# EasyEDA schematic SCH_Schematic-PCB-FC-TD_2026-05-04.json
TITLE: Flight Controller; REV: 1.0; Date: 2026-04-28; Sheet: 1/1; Drawn By: dimassetya737; Company: Dwi Cakra
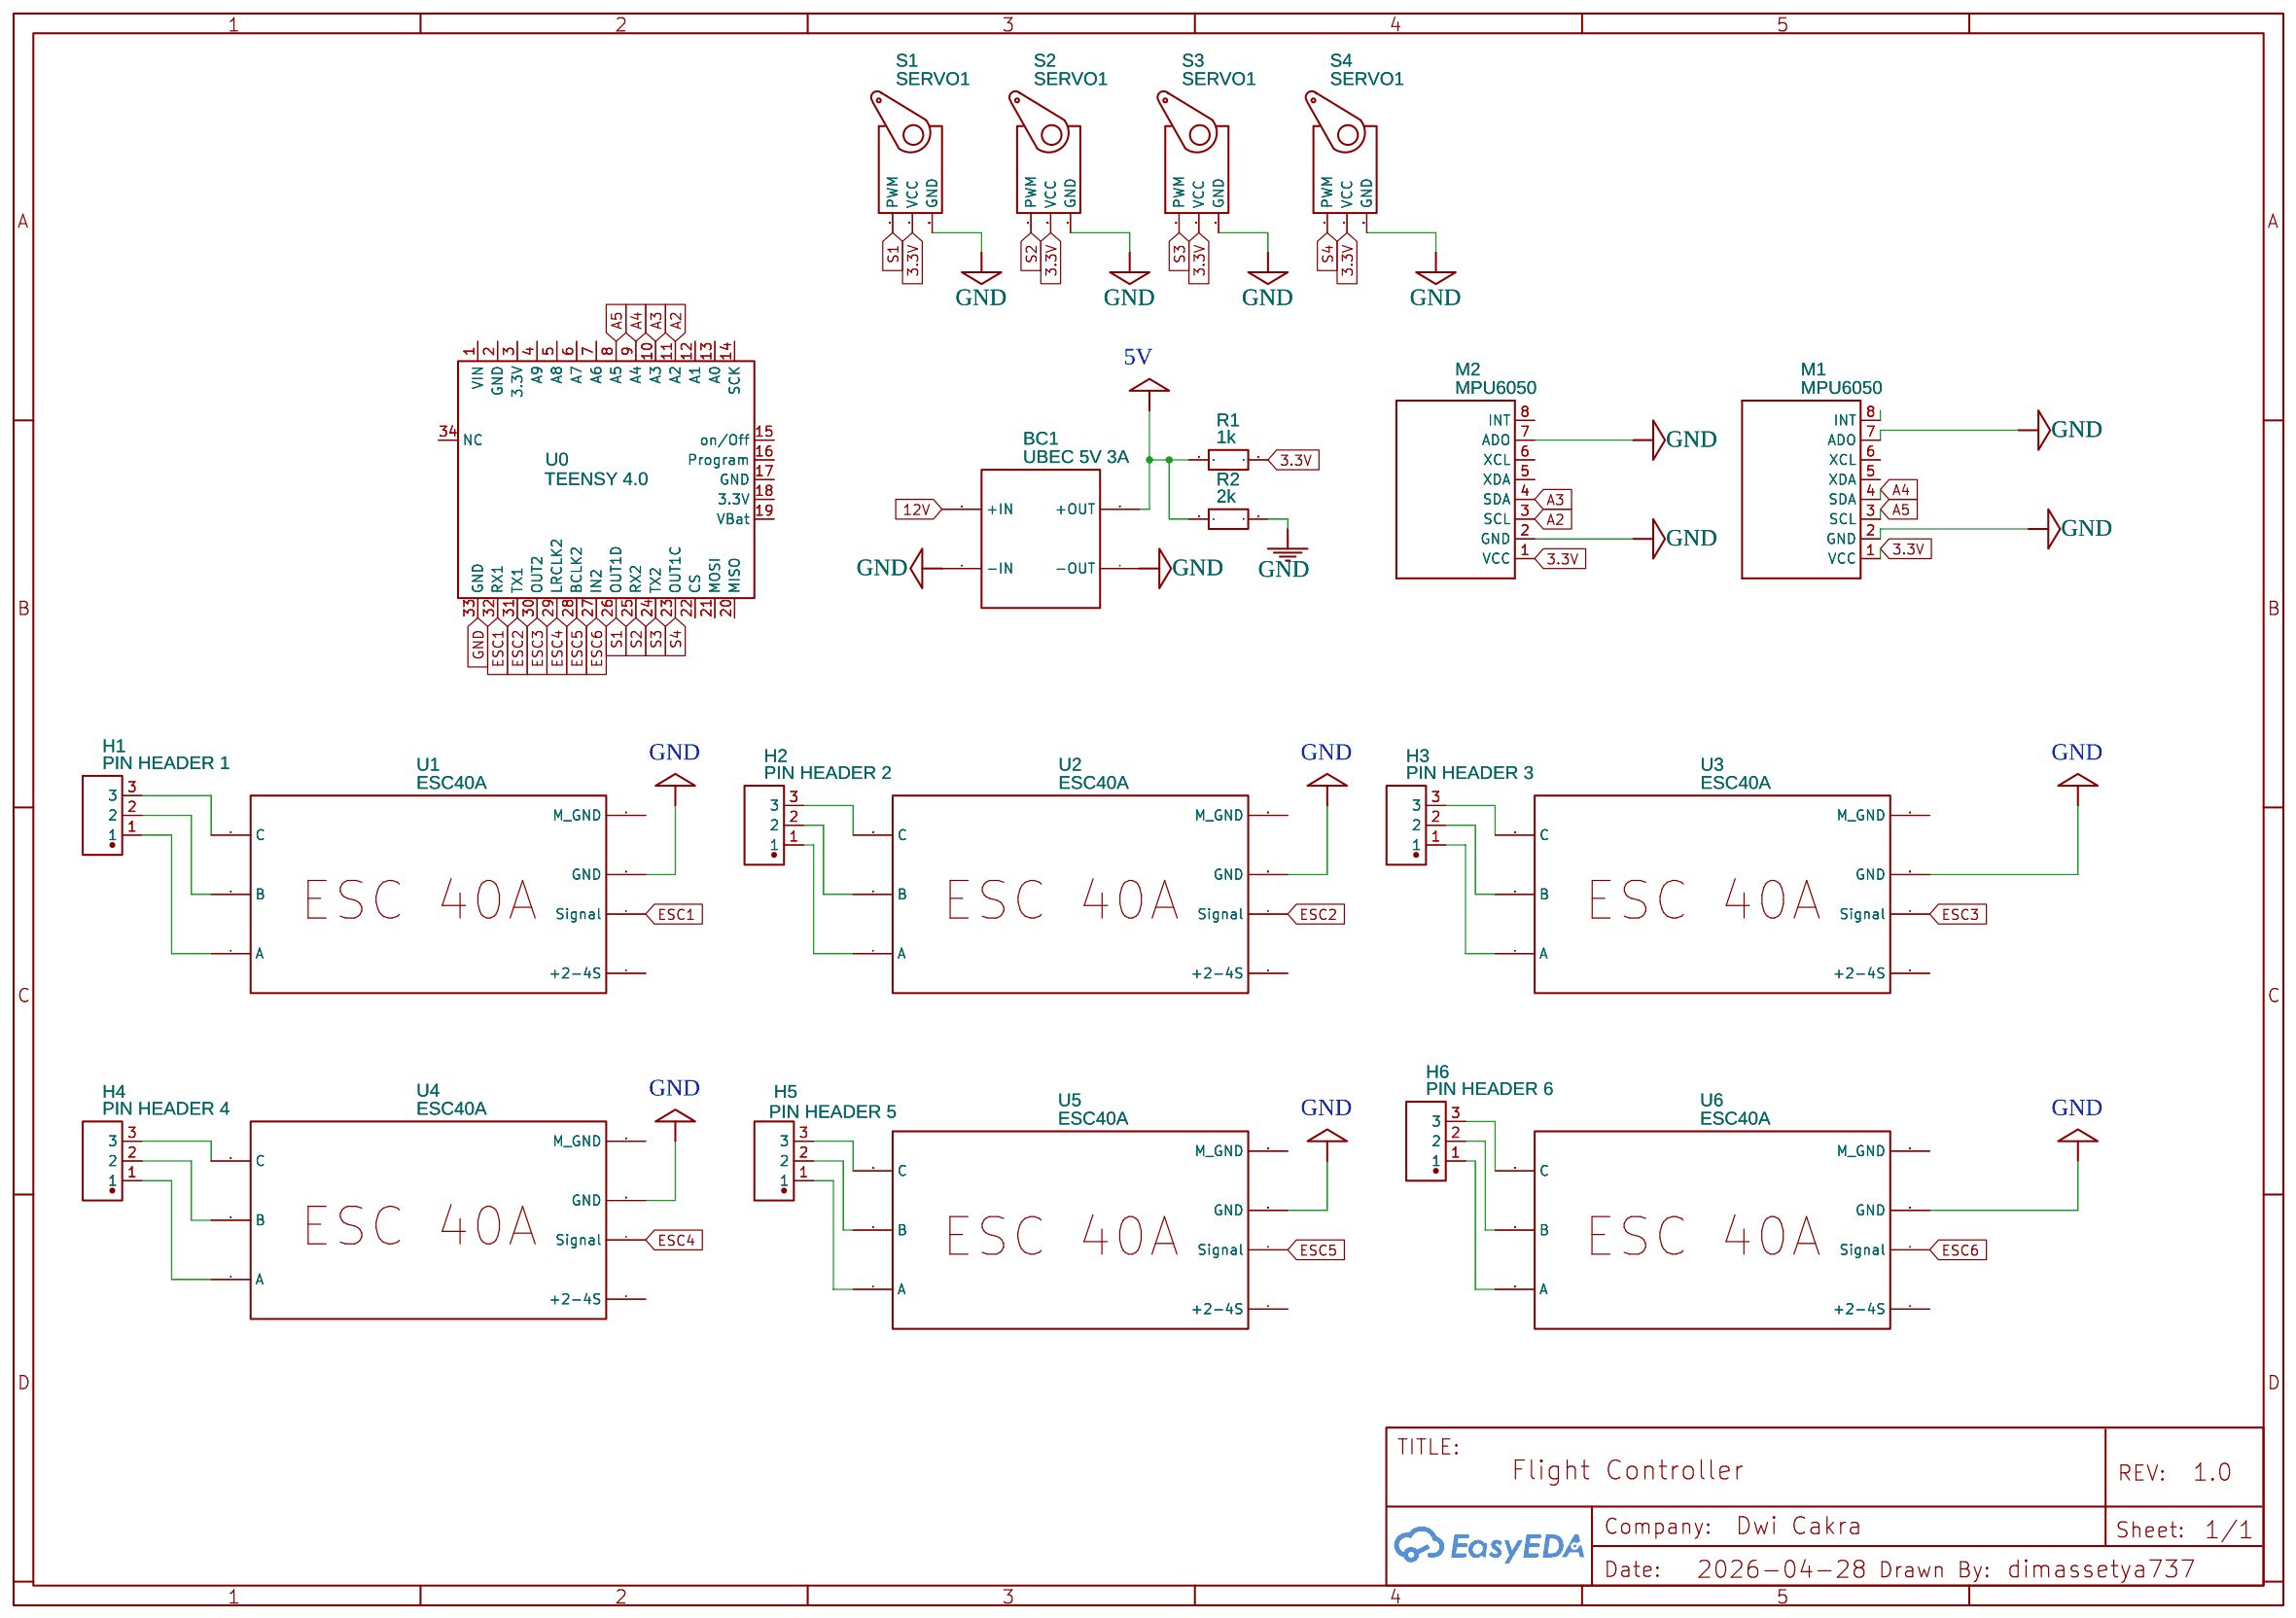
[diagram p0: schematic sheet]

## Parts
BC1  UBEC 5V 3A  [UBEC_5V_3A]
H1  PIN HEADER 1  [HDR-TH_3P-P2.54-V-M-1]
H2  PIN HEADER 2  [HDR-TH_3P-P2.54-V-M-1]
H3  PIN HEADER 3  [HDR-TH_3P-P2.54-V-M-1]
H4  PIN HEADER 4  [HDR-TH_3P-P2.54-V-M-1]
H5  PIN HEADER 5  [HDR-TH_3P-P2.54-V-M-1]
H6  PIN HEADER 6  [HDR-TH_3P-P2.54-V-M-1]
M1  MPU6050  [MPU6050]
M2  MPU6050  [MPU6050]
R1  1k  [R0603]
R2  2k  [R0603]
S1  SERVO1  [MG90S SERVO ADAL]
S2  SERVO1  [MG90S SERVO ADAL]
S3  SERVO1  [MG90S SERVO ADAL]
S4  SERVO1  [MG90S SERVO ADAL]
U0  TEENSY 4.0  [COMM-TH_34P-L35.6-W17.8-P2.54_C9900133251]
U1  ESC40A
U2  ESC40A
U3  ESC40A
U4  ESC40A
U5  ESC40A
U6  ESC40A

## Library data of the parts
BC1 = UBEC 5V 3A: Contributor: ilhamkurnia
H1-H6 = HX PH254-01-03-Z-L11.5 PCB PIN HEADER: Supplier: LCSC; Supplier Part: C52016391; Manufacturer: hanxia(韩下); Manufacturer Part: HX PH254-01-03-Z-L11.5 pcb pin header; JLCPCB Part Class: Extended Part; Contributor: lcsc
M1 M2 = MPU6050: Contributor: Hassan80046
R1 R2 = 贴片电阻CHIPRESISTORS: Contributor: lcsc; Supplier: LCSC; Supplier Part: C9900014833; Manufacturer: null; Manufacturer Part: 贴片电阻ChipResistors; JLCPCB Part Class: Extended Part
S1-S4 = SERVO MG90S: Contributor: poramat.sa
U0 = TEENSY 4.0: Supplier: LCSC; Supplier Part: C9900133251; Manufacturer: null; Manufacturer Part: Teensy 4.0; JLCPCB Part Class: Extended Part; Contributor: lcsc
U1-U6 = ESC40A: Contributor: pp.napapol

## Nets
3.3V: M1.1(VCC) M2.1(VCC) R1.2 S1.VCC S2.VCC S3.VCC S4.VCC
5V: BC1.3(+OUT) R1.1 R2.1
12V: BC1.2(+IN)
GND: BC1.1(-IN) BC1.4(-OUT) M1.2(GND) M1.7(ADO) M2.2(GND) M2.7(ADO) R2.2 S1.GND S2.GND S3.GND S4.GND U0.33(GND) U1.6(GND) U2.6(GND) U3.6(GND) U4.6(GND) U5.6(GND) U6.6(GND)
A2: M2.3(SCL) U0.11(A2)
A3: M2.4(SDA) U0.10(A3)
A4: M1.4(SDA) U0.9(A4)
A5: M1.3(SCL) U0.8(A5)
ESC1: U0.32(RX1) U1.7(Signal)
ESC2: U0.31(TX1) U2.7(Signal)
ESC3: U0.30(OUT2) U3.7(Signal)
ESC4: U0.29(LRCLK2) U4.7(Signal)
ESC5: U0.28(BCLK2) U5.7(Signal)
ESC6: U0.27(IN2) U6.7(Signal)
S1: S1.PWM U0.26(OUT1D)
S2: S2.PWM U0.25(RX2)
S3: S3.PWM U0.24(TX2)
S4: S4.PWM U0.23(OUT1C)
Net-(H1-1): H1.1 U1.1(A)
Net-(H1-2): H1.2 U1.2(B)
Net-(H1-3): H1.3 U1.3(C)
Net-(H2-1): H2.1 U2.1(A)
Net-(H2-2): H2.2 U2.2(B)
Net-(H2-3): H2.3 U2.3(C)
Net-(H3-1): H3.1 U3.1(A)
Net-(H3-2): H3.2 U3.2(B)
Net-(H3-3): H3.3 U3.3(C)
Net-(H4-1): H4.1 U4.1(A)
Net-(H4-2): H4.2 U4.2(B)
Net-(H4-3): H4.3 U4.3(C)
Net-(H5-1): H5.1 U5.1(A)
Net-(H5-2): H5.2 U5.2(B)
Net-(H5-3): H5.3 U5.3(C)
Net-(H6-1): H6.1 U6.1(A)
Net-(H6-2): H6.2 U6.2(B)
Net-(H6-3): H6.3 U6.3(C)

Not connected (* = marked no-connect by the designer): M1 5(XDA) 6(XCL) 8(INT); M2 5(XDA) 6(XCL) 8(INT); U0 1(VIN) 2(GND) 3(3.3V) 4(A9) 5(A8) 6(A7) 7(A6) 12(A1) 13(A0) 14(SCK) 15(on/Off) 16(Program) 17(GND) 18(3.3V) 19(VBat) 20(MISO) 21(MOSI) 22(CS) 34(NC); U1 4(+2-4S) 5(M_GND); U2 4(+2-4S) 5(M_GND); U3 4(+2-4S) 5(M_GND); U4 4(+2-4S) 5(M_GND); U5 4(+2-4S) 5(M_GND); U6 4(+2-4S) 5(M_GND)
